# Altium schematic sheet voltage_regulation.SchDoc: Voltage Regulation Unit
size A4; Author: Robocup; Organization: Hamburg Bit-Bots; Address1: Vogt-Kölln-Str. 30; Address2: 225257 Hamburg; Address3: Germany; Address4: www.bit-bots.de; DocumentNumber: 4; Revision: A; SheetNumber: 4; SheetTotal: 7; EMail: info@bit-bots.de
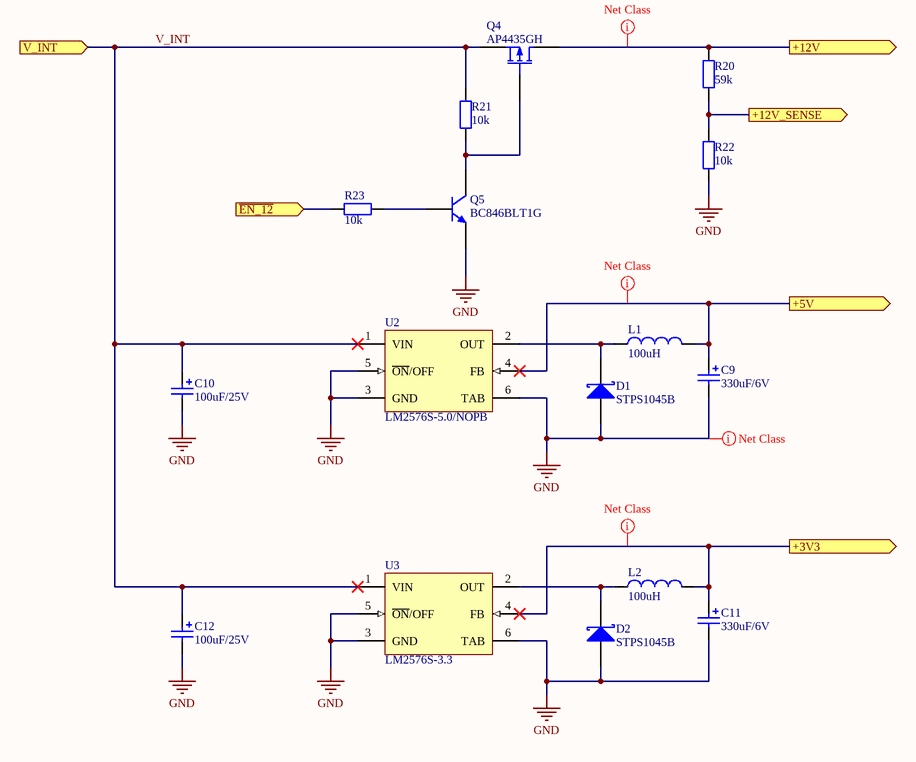
[diagram p0: voltage_regulation.SchDoc]

## Parts
C9  330uF/6V  [Cap 10mm]
C10  100uF/25V  [Cap 6.3mm]
C11  330uF/6V  [Cap 10mm]
C12  100uF/25V  [Cap 6.3mm]
D1  STPS1045B  [DPAK]
D2  STPS1045B  [DPAK]
L1  100uH  [PISR]
L2  100uH  [PISR]
Q4  AP4435GH  [TO-252_N]
Q5  BC846BLT1G  [SOT-23-TT3_N]
R20  59k  [R2012]
R21  10k  [R2012]
R22  10k  [R2012]
R23  10k  [R2012]
U2  LM2576S-5.0/NOPB  [TO263-5]
U3  LM2576S-3.3  [TO263-5]

## Ports
+3V3 (out), +5V (out), +12V (out), +12V_SENSE (out), V_INT (in), ~{EN_12} (in)

## Nets
GND: C9.2 C10.2 C11.2 C12.2 D1.1(A) D1.3(A2) D2.1(A) D2.3(A2) Q5.2(E) R22.1 U2.3(GND) U2.5(~{ON}/OFF) U2.6(TAB) U3.3(GND) U3.5(~{ON}/OFF) U3.6(TAB)
+3V3: C11.1 L2.2 U3.4(FB) ; port +3V3
+5V: C9.1 L1.2 U2.4(FB) ; port +5V
+12V: Q4.4(D) R20.2 ; port +12V
+12V_SENSE: R20.1 R22.2 ; port +12V_SENSE
~{EN_12}: R23.2 ; port ~{EN_12}
V_INT: C10.1 C12.1 Q4.3(S) R21.2 U2.1(VIN) U3.1(VIN) ; port V_INT
NetD1_2: D1.2(K) L1.1 U2.2(OUT)
NetD2_2: D2.2(K) L2.1 U3.2(OUT)
NetQ4_1: Q4.1(G) Q5.3(C) R21.1
NetQ5_1: Q5.1(B) R23.1

## Layout directives
net class HighCurrent: +3V3, +5V, +12V, GND

## Notes on the sheet
- Project:
- Author:
- Title:
- Rev:
- Date:
- Time:
- Sheet
- of

## Library data of the parts
C9-C12 = Cap Pol2: Polarized Capacitor (Axial); Published: 8-Jun-2000; LatestRevisionDate: 17-Jul-2002; LatestRevisionNote: Re-released for DXP Platform.; PackageReference: POLAR0.8; Publisher: Altium Limited; PackageDescription: Polarized Capacitor; 2 Leads
  C9 C11: Value: 330uF/6V
  C10 C12: Value: 100uF/25V
D1 D2 = Diode 10TQ035: Schottky Rectifier; pin to pad: 1,3>1+3; Published: 8-Jun-2000; PackageVersion: Feb-1998; PackageReference: TO-220AC; Publisher: Altium Limited; PackageDescription: TO, Thru-Hole, Vertical, Heatsink Mounted; 3 In-Line Leads (1 Absent); Pitch 2.54 mm
L1 L2 = Inductor: Code_IEC: 1005; Published: 8-Jun-2000; LatestRevisionDate: 29-May-2009; LatestRevisionNote: IPC-7351 Footprint Added.; PackageReference: 0402-A; Publisher: Altium Limited; PackageDescription: Chip Inductor; Code_JEITA: 0402; Value: 100uH
Q4 = MOSFET-P: P-Channel MOSFET; Published: 8-Jun-2000; LatestRevisionDate: 17-Jul-2002; LatestRevisionNote: Re-released for DXP Platform.; PackageVersion: 1995/1996; PackageReference: E3; Publisher: Altium Limited; PackageDescription: TO, Flat Index; 3 In-Line, Axial Leads; Body Dia. 4.6mm; Lead Dia. 0.5 mm (max)
Q5 = NPN: NPN Bipolar Transistor; Published: 8-Jun-2000; LatestRevisionDate: 17-Jul-2002; LatestRevisionNote: Re-released for DXP Platform.; PackageReference: TO-226-AA; Publisher: Altium Limited; PackageDescription: TO, Flat Index; 3 In-Line, Axial Leads; Body Dia. 4.8mm; Leads 0.55 x 0.51 mm (max); Code_JEDEC: TO-226-AA
R20-R23 = Res2: Resistor; Published: 8-Jun-2000; LatestRevisionDate: 17-Jul-2002; LatestRevisionNote: Re-released for DXP Platform.; PackageReference: AXIAL-0.4; Publisher: Altium Limited; PackageDescription: Axial Device, Thru-Hole; 2 Leads; 0.4 in Pin Spacing
  R20: Value: 59k
  R21-R23: Value: 10k
U2 = CMP-0069-00114-2: SIMPLE SWITCHER® 3A Step-Down Voltage Regulator, 5-pin TO-263, Pb-Free; Manufacturer: National Semiconductor; PackageTopMarking: NSUZXYTTE#*LM2576S*-5.0 P+; PowerWise: N; ComponentLink3Description: TS5B Package Page; PinCount: 5; PackageDescription: TO-263, Molded, .400 x .390 x .180in, 5 Lead, .067in Pitch, Surface Mount; ComponentLink3URL: http://www.national.com/packaging/folders/ts5b.html; CompType: Switcher; ComponentLink1URL: http://www.national.com/ds/LM/LM2576.pdf; PackageReference: TS5B; PackageVersion: revD, Apr-2005; ComponentLink2URL: http://www.national.com/pf/LM/LM2576.html; Code_JEDEC: MO-169-AB; ComponentLink1Description: LM2576 Datasheet; ComponentLink2Description: LM2576 Web Page; RevisionNote: Component URLs added; DatasheetVersion: Aug-2004; RoHS: Y
U3 = CMP-0069-00113-2: SIMPLE SWITCHER® 3A Step-Down Voltage Regulator, 5-pin TO-263; Manufacturer: National Semiconductor; PackageTopMarking: NSUZXYTTE#*LM2576S*-3.3 P+; PowerWise: N; ComponentLink2URL: http://www.national.com/pf/LM/LM2576.html; ComponentLink1URL: http://www.national.com/ds/LM/LM2576.pdf; Code_JEDEC: MO-169-AB; RoHS: N; ComponentLink3Description: TS5B Package Page; PackageReference: TS5B; CompType: Switcher; RevisionNote: Component URLs added; DatasheetVersion: Aug-2004; ComponentLink2Description: LM2576 Web Page; ComponentLink1Description: LM2576 Datasheet; PackageDescription: TO-263, Molded, .400 x .390 x .180in, 5 Lead, .067in Pitch, Surface Mount; ComponentLink3URL: http://www.national.com/packaging/folders/ts5b.html; PackageVersion: revD, Apr-2005; PinCount: 5